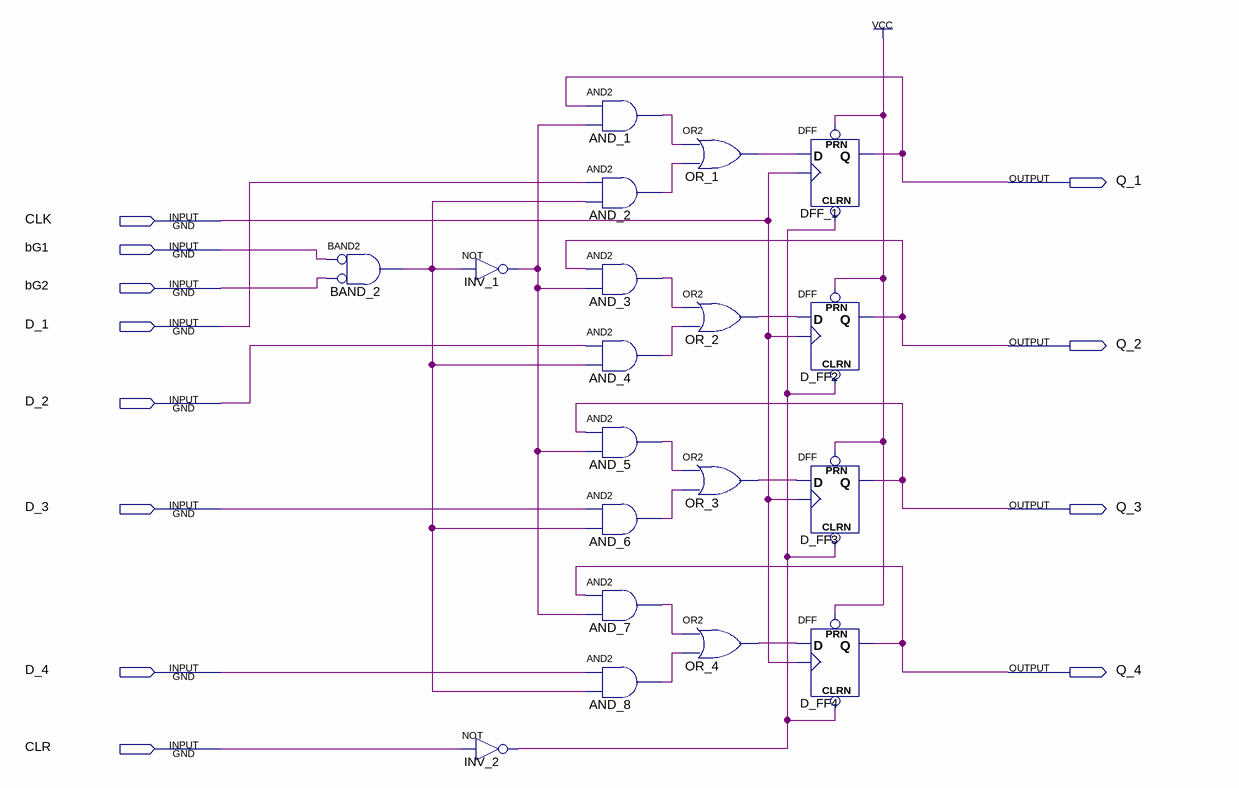
[diagram p0: schematic sheet]
// Quartus schematic IC_74LS173_RTL.bdf as structural Verilog: 19 symbols, 12 pins
module IC_74LS173_RTL (
  input  CLK,
  input  bG1,
  input  bG2,
  input  D_1,
  input  D_2,
  input  D_3,
  input  D_4,
  input  CLR,
  output Q_1,
  output Q_2,
  output Q_3,
  output Q_4
);

  wire AND_1_out, AND_2_out, AND_3_out, AND_4_out, AND_5_out, AND_6_out, AND_7_out, AND_8_out, BAND_2_out,
       INV_1_out, INV_2_out, OR_1_out, OR_2_out, OR_3_out, OR_4_out;

  and BAND_2 (BAND_2_out, ~bG1, ~bG2);  // BAND2
  not INV_1 (INV_1_out, BAND_2_out);
  not INV_2 (INV_2_out, CLR);
  and AND_1 (AND_1_out, Q_1, INV_1_out);
  and AND_2 (AND_2_out, D_1, BAND_2_out);
  and AND_3 (AND_3_out, Q_2, INV_1_out);
  and AND_4 (AND_4_out, D_2, BAND_2_out);
  and AND_5 (AND_5_out, Q_3, INV_1_out);
  and AND_6 (AND_6_out, D_3, BAND_2_out);
  and AND_7 (AND_7_out, Q_4, INV_1_out);
  and AND_8 (AND_8_out, D_4, BAND_2_out);
  or OR_1 (OR_1_out, AND_1_out, AND_2_out);
  or OR_2 (OR_2_out, AND_3_out, AND_4_out);
  or OR_3 (OR_3_out, AND_5_out, AND_6_out);
  or OR_4 (OR_4_out, AND_7_out, AND_8_out);
  DFF DFF_1 (.CLRN(INV_2_out), .CLK(CLK), .D(OR_1_out), .PRN(1'b1), .Q(Q_1));
  DFF D_FF2 (.CLRN(INV_2_out), .CLK(CLK), .D(OR_2_out), .PRN(1'b1), .Q(Q_2));
  DFF D_FF3 (.CLRN(INV_2_out), .CLK(CLK), .D(OR_3_out), .PRN(1'b1), .Q(Q_3));
  DFF D_FF4 (.CLRN(INV_2_out), .CLK(CLK), .D(OR_4_out), .PRN(1'b1), .Q(Q_4));
endmodule
